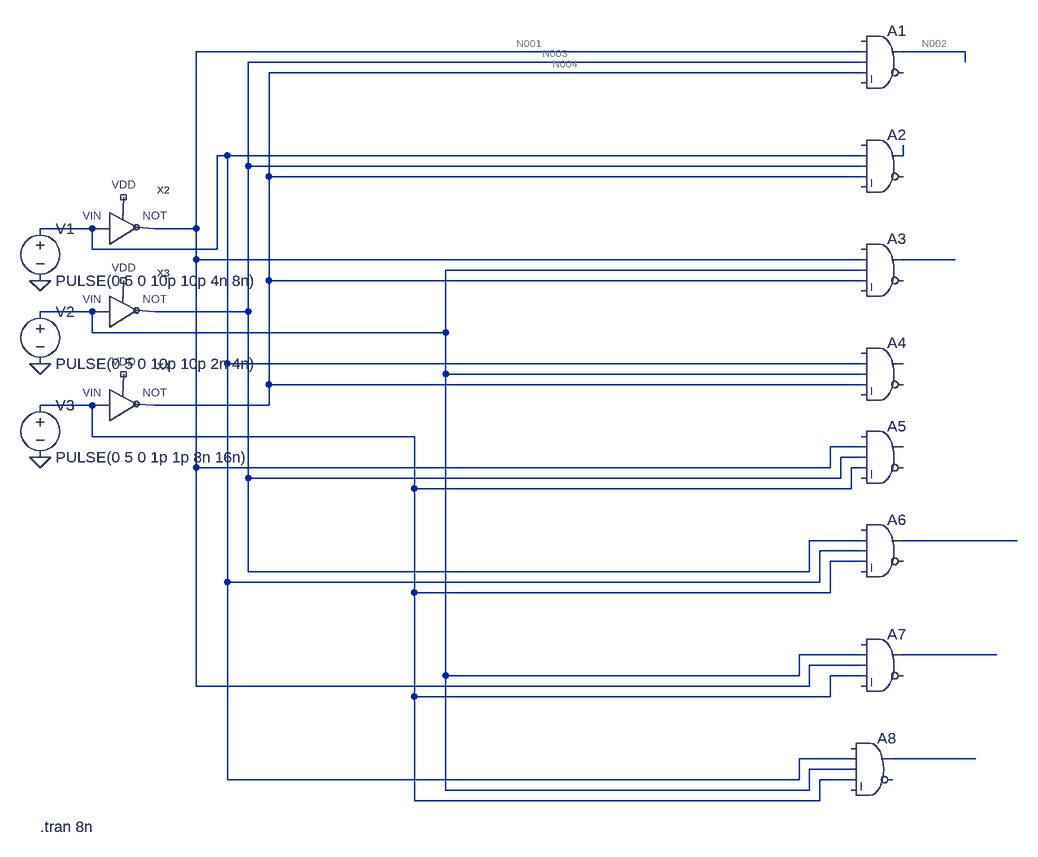
[diagram p0: schematic All.asc]
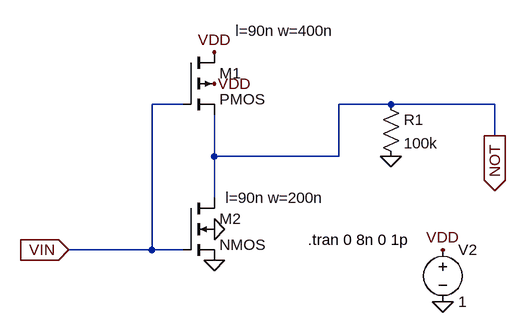
[diagram p1: sub-circuit not.asc]
All.asc, the LTspice schematic file:
Version 4
SHEET 1 1236 936
WIRE 992 -272 -32 -272
WIRE 1152 -272 1056 -272
WIRE 992 -256 48 -256
WIRE 1152 -256 1152 -272
WIRE 992 -240 80 -240
WIRE 16 -112 0 -112
WIRE 992 -112 16 -112
WIRE 1056 -112 1056 -128
WIRE 48 -96 48 -256
WIRE 992 -96 48 -96
WIRE 80 -80 80 -240
WIRE 992 -80 80 -80
WIRE -192 0 -272 0
WIRE -32 0 -32 -272
WIRE -32 0 -96 0
WIRE -192 32 -192 0
WIRE 0 32 0 -112
WIRE 0 32 -192 32
WIRE -32 48 -32 0
WIRE 992 48 -32 48
WIRE 1136 48 1056 48
WIRE 992 64 352 64
WIRE 80 80 80 -80
WIRE 992 80 80 80
WIRE -192 128 -272 128
WIRE 48 128 48 -96
WIRE 48 128 -96 128
WIRE -192 160 -192 128
WIRE 352 160 352 64
WIRE 352 160 -192 160
WIRE 16 208 16 -112
WIRE 992 208 16 208
WIRE 1056 208 1040 208
WIRE 352 224 352 160
WIRE 992 224 352 224
WIRE 80 240 80 80
WIRE 992 240 80 240
WIRE -192 272 -272 272
WIRE 80 272 80 240
WIRE 80 272 -96 272
WIRE -192 320 -192 272
WIRE 304 320 -192 320
WIRE 992 336 944 336
WIRE 992 352 960 352
WIRE -32 368 -32 48
WIRE 944 368 944 336
WIRE 944 368 -32 368
WIRE 992 368 976 368
WIRE 48 384 48 128
WIRE 960 384 960 352
WIRE 960 384 48 384
WIRE 304 400 304 320
WIRE 976 400 976 368
WIRE 976 400 304 400
WIRE 992 480 912 480
WIRE 1232 480 1056 480
WIRE 992 496 928 496
WIRE 992 512 944 512
WIRE 48 528 48 384
WIRE 912 528 912 480
WIRE 912 528 48 528
WIRE 16 544 16 208
WIRE 928 544 928 496
WIRE 928 544 16 544
WIRE 304 560 304 400
WIRE 944 560 944 512
WIRE 944 560 304 560
WIRE 992 656 896 656
WIRE 1200 656 1056 656
WIRE 992 672 912 672
WIRE 352 688 352 224
WIRE 896 688 896 656
WIRE 896 688 352 688
WIRE 992 688 944 688
WIRE -32 704 -32 368
WIRE 912 704 912 672
WIRE 912 704 -32 704
WIRE 304 720 304 560
WIRE 944 720 944 688
WIRE 944 720 304 720
WIRE 976 816 896 816
WIRE 1168 816 1040 816
WIRE 976 832 912 832
WIRE 16 848 16 544
WIRE 896 848 896 816
WIRE 896 848 16 848
WIRE 976 848 928 848
WIRE 352 864 352 688
WIRE 912 864 912 832
WIRE 912 864 352 864
WIRE 304 880 304 720
WIRE 928 880 928 848
WIRE 928 880 304 880
FLAG -272 208 0
FLAG -272 352 0
FLAG -272 80 0
SYMBOL Not -192 0 R0
SYMATTR InstName X2
SYMBOL Not -192 128 R0
SYMATTR InstName X3
SYMBOL Not -192 272 R0
SYMATTR InstName X4
SYMBOL voltage -272 -16 R0
WINDOW 123 0 0 Left 0
WINDOW 39 0 0 Left 0
SYMATTR InstName V1
SYMATTR Value PULSE(0 5 0 10p 10p 4n 8n)
SYMBOL voltage -272 112 R0
WINDOW 123 0 0 Left 0
WINDOW 39 0 0 Left 0
SYMATTR InstName V2
SYMATTR Value PULSE(0 5 0 10p 10p 2n 4n)
SYMBOL voltage -272 256 R0
WINDOW 123 0 0 Left 0
WINDOW 39 0 0 Left 0
SYMATTR InstName V3
SYMATTR Value PULSE(0 5 0 1p 1p 8n 16n)
SYMBOL Digital\\and 1024 -320 R0
SYMATTR InstName A1
SYMBOL Digital\\and 1024 -160 R0
SYMATTR InstName A2
SYMBOL Digital\\and 1024 0 R0
SYMATTR InstName A3
SYMBOL Digital\\and 1024 160 R0
SYMATTR InstName A4
SYMBOL Digital\\and 1024 288 R0
SYMATTR InstName A5
SYMBOL Digital\\and 1024 432 R0
SYMATTR InstName A6
SYMBOL Digital\\and 1024 608 R0
SYMATTR InstName A7
SYMBOL Digital\\and 1008 768 R0
SYMATTR InstName A8
TEXT -272 920 Left 2 !.tran 8n

not.asc, the sub-circuit schematic file:
Version 4
SHEET 1 880 680
WIRE 96 -208 48 -208
WIRE 416 -208 336 -208
WIRE 576 -208 416 -208
WIRE 576 -160 576 -208
WIRE 144 -128 144 -192
WIRE 336 -128 336 -208
WIRE 336 -128 144 -128
WIRE 144 -64 144 -128
WIRE 48 16 48 -208
WIRE 48 16 -80 16
WIRE 96 16 48 16
FLAG 144 32 0
FLAG 144 -16 0
FLAG 496 96 0
FLAG 496 16 VDD
FLAG 144 -288 VDD
FLAG 144 -240 VDD
FLAG 576 -160 NOT
IOPIN 576 -160 Out
FLAG 416 -128 0
FLAG -80 16 VIN
IOPIN -80 16 In
SYMBOL pmos4 96 -288 R0
WINDOW 123 81 -33 Left 2
SYMATTR Value2 l=90n w=400n
SYMATTR InstName M1
SYMBOL nmos4 96 -64 R0
WINDOW 123 65 0 Left 2
SYMATTR Value2 l=90n w=200n
SYMATTR InstName M2
SYMBOL voltage 496 0 R0
WINDOW 123 0 0 Left 0
WINDOW 39 0 0 Left 0
SYMATTR InstName V2
SYMATTR Value 1
SYMBOL res 400 -224 R0
SYMATTR InstName R1
SYMATTR Value 100k
TEXT 288 0 Left 2 !.tran 0 8n 0 1p

The netlist it stands for:
* All.asc
XX2 N005 N001 NC_01 not
XX3 N008 N003 NC_02 not
XX4 N010 N004 NC_03 not
V1 N005 0 PULSE(0 5 0 10p 10p 4n 8n)
V2 N008 0 PULSE(0 5 0 10p 10p 2n 4n)
V3 N010 0 PULSE(0 5 0 1p 1p 8n 16n)
A1 0 N001 N003 N004 0 0 N002 0 AND
A2 0 N005 N003 N004 0 0 N006 0 AND
A3 0 N001 N008 N004 0 0 N007 0 AND
A4 0 N005 N008 N004 0 0 N009 0 AND
A5 0 N001 N003 N010 0 0 0 0 AND
A6 0 N003 N005 N010 0 0 N011 0 AND
A7 0 N008 N001 N010 0 0 N012 0 AND
A8 0 N005 N008 N010 0 0 N013 0 AND

* block symbol definitions
.subckt not VIN NOT VDD
M1 VDD VIN NOT VDD PMOS l=90n w=400n
M2 NOT VIN 0 0 NMOS l=90n w=200n
V2 VDD 0 1
R1 NOT 0 100k
.tran 0 8n 0 1p
.ends not

.model NMOS NMOS
.model PMOS PMOS
.lib standard.mos
.tran 8n
.backanno
.end

* Results of the author's LTspice run, read from the files saved beside the schematic
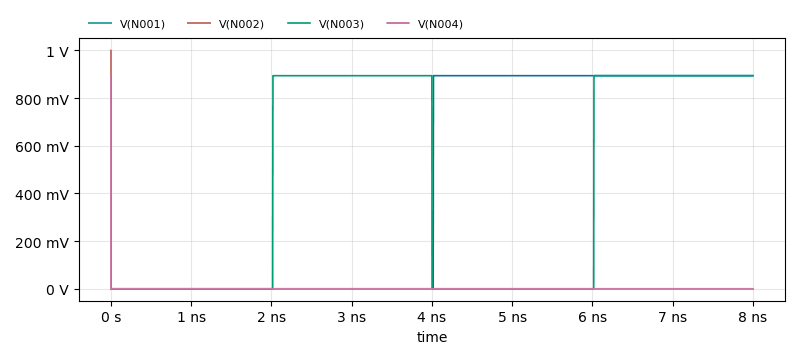
[diagram p2: Transient Analysis of All.asc, plotted from the saved traces]
* Transient Analysis, 1 run:
*   V(N001): min 0 V, max 893.9 mV, average 445 mV, rms 630.6 mV, last 893.8 mV
*   V(N002): min 0 V, max 1 V, average 15 µV, rms 3.873 mV, last 0 V
*   V(N003): min 0 V, max 893.9 mV, average 443.1 mV, rms 629.3 mV, last 893.8 mV
*   V(N004): min -106 nV, max 893.8 mV, average 12.66 µV, rms 3.126 mV, last 0 V